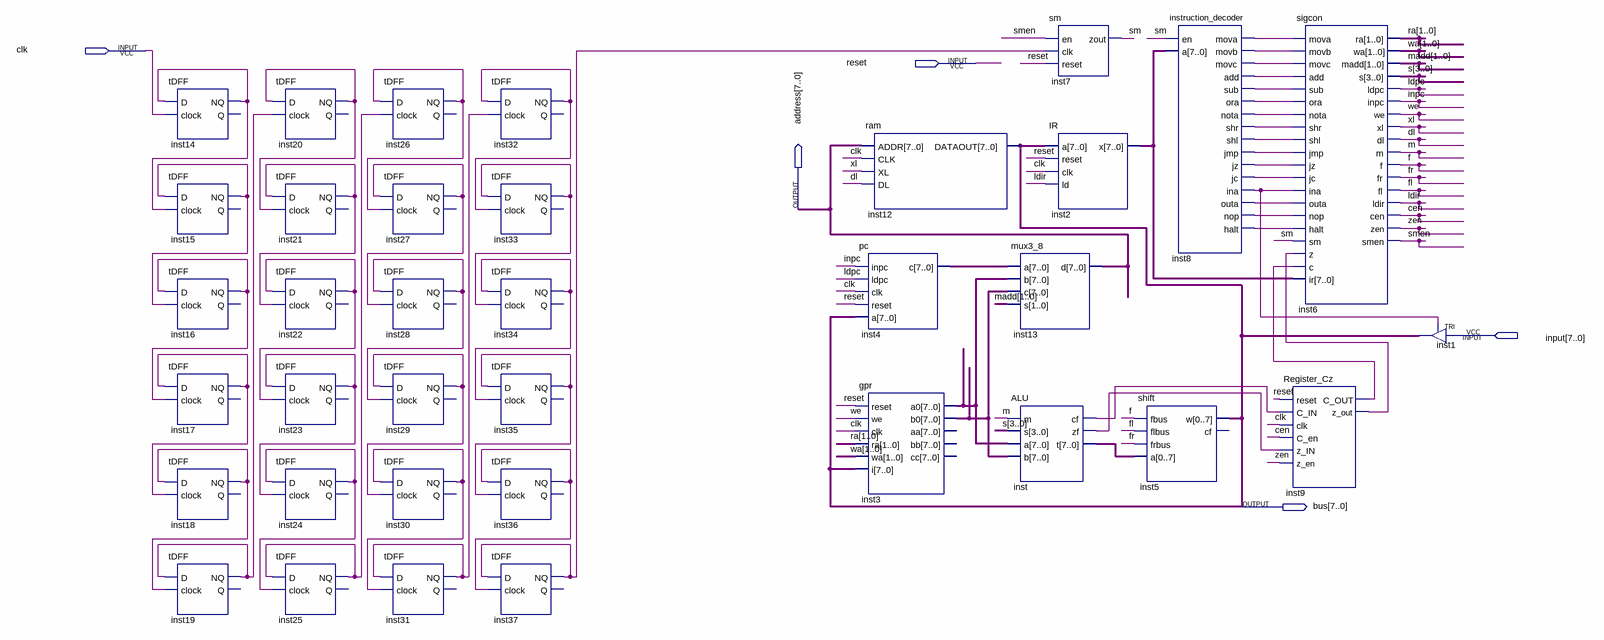
[diagram p0: schematic sheet]
// Quartus schematic cpu.bdf as structural Verilog: 36 symbols, 5 pins
module cpu (
  input  clk,
  input  reset,
  input  [7:0] \input ,
  output [7:0] address,
  output [7:0] bus
);

  wire cen, dl, f, fl, fr, inpc, inst8_add, inst8_halt, inst8_ina, inst8_jc, inst8_jmp, inst8_jz, inst8_mova,
       inst8_movb, inst8_movc, inst8_nop, inst8_nota, inst8_ora, inst8_outa, inst8_shl, inst8_shr, inst8_sub,
       inst9_c_out, inst9_z_out, inst14_nq, inst15_nq, inst16_nq, inst17_nq, inst18_nq, inst19_nq, inst20_nq,
       inst21_nq, inst22_nq, inst23_nq, inst24_nq, inst25_nq, inst26_nq, inst27_nq, inst28_nq, inst29_nq,
       inst30_nq, inst31_nq, inst32_nq, inst33_nq, inst34_nq, inst35_nq, inst36_nq, inst37_nq, inst_cf,
       inst_zf, ldir, ldpc, m, sm, smen, we, xl, zen;
  wire [1:0] madd, ra, wa;
  wire [3:0] s;
  wire [7:0] inst2_x, inst3_a0, inst3_b0, inst4_c, inst_t;

  tDFF inst14 (.D(inst14_nq), .clock(clk), .NQ(inst14_nq));  // open: Q
  tDFF inst15 (.D(inst15_nq), .clock(inst14_nq), .NQ(inst15_nq));  // open: Q
  tDFF inst16 (.D(inst16_nq), .clock(inst15_nq), .NQ(inst16_nq));  // open: Q
  tDFF inst17 (.D(inst17_nq), .clock(inst16_nq), .NQ(inst17_nq));  // open: Q
  tDFF inst18 (.D(inst18_nq), .clock(inst17_nq), .NQ(inst18_nq));  // open: Q
  tDFF inst19 (.D(inst19_nq), .clock(inst18_nq), .NQ(inst19_nq));  // open: Q
  tDFF inst20 (.D(inst20_nq), .clock(inst19_nq), .NQ(inst20_nq));  // open: Q
  tDFF inst21 (.D(inst21_nq), .clock(inst20_nq), .NQ(inst21_nq));  // open: Q
  tDFF inst22 (.D(inst22_nq), .clock(inst21_nq), .NQ(inst22_nq));  // open: Q
  tDFF inst23 (.D(inst23_nq), .clock(inst22_nq), .NQ(inst23_nq));  // open: Q
  tDFF inst24 (.D(inst24_nq), .clock(inst23_nq), .NQ(inst24_nq));  // open: Q
  tDFF inst25 (.D(inst25_nq), .clock(inst24_nq), .NQ(inst25_nq));  // open: Q
  tDFF inst26 (.D(inst26_nq), .clock(inst25_nq), .NQ(inst26_nq));  // open: Q
  tDFF inst27 (.D(inst27_nq), .clock(inst26_nq), .NQ(inst27_nq));  // open: Q
  tDFF inst28 (.D(inst28_nq), .clock(inst27_nq), .NQ(inst28_nq));  // open: Q
  tDFF inst29 (.D(inst29_nq), .clock(inst28_nq), .NQ(inst29_nq));  // open: Q
  tDFF inst30 (.D(inst30_nq), .clock(inst29_nq), .NQ(inst30_nq));  // open: Q
  tDFF inst31 (.D(inst31_nq), .clock(inst30_nq), .NQ(inst31_nq));  // open: Q
  tDFF inst32 (.D(inst32_nq), .clock(inst31_nq), .NQ(inst32_nq));  // open: Q
  tDFF inst33 (.D(inst33_nq), .clock(inst32_nq), .NQ(inst33_nq));  // open: Q
  tDFF inst34 (.D(inst34_nq), .clock(inst33_nq), .NQ(inst34_nq));  // open: Q
  tDFF inst35 (.D(inst35_nq), .clock(inst34_nq), .NQ(inst35_nq));  // open: Q
  tDFF inst36 (.D(inst36_nq), .clock(inst35_nq), .NQ(inst36_nq));  // open: Q
  tDFF inst37 (.D(inst37_nq), .clock(inst36_nq), .NQ(inst37_nq));  // open: Q
  ram inst12 (.ADDR(address), .CLK(clk), .XL(xl), .DL(dl), .DATAOUT(bus));
  pc inst4 (.inpc(inpc), .ldpc(ldpc), .clk(clk), .reset(reset), .a(bus), .c(inst4_c));
  gpr inst3 (
    .reset(reset), .we(we), .clk(clk), .ra(ra), .wa(wa), .i(bus), .a0(inst3_a0), .b0(inst3_b0));  // open: aa, bb, cc
  mux3_8 inst13 (.a(inst4_c), .b(inst3_a0), .c(inst3_b0), .s(madd), .d(address));
  ALU inst (.m(m), .s(s), .a(inst3_a0), .b(inst3_b0), .cf(inst_cf), .zf(inst_zf), .t(inst_t));
  sm inst7 (.en(smen), .clk(inst37_nq), .reset(reset), .zout(sm));
  IR inst2 (.a(bus), .reset(reset), .clk(clk), .ld(ldir), .x(inst2_x));
  instruction_decoder inst8 (
    .en(sm), .a(inst2_x), .mova(inst8_mova), .movb(inst8_movb), .movc(inst8_movc), .add(inst8_add),
    .sub(inst8_sub), .ora(inst8_ora), .nota(inst8_nota), .shr(inst8_shr), .shl(inst8_shl), .jmp(inst8_jmp),
    .jz(inst8_jz), .jc(inst8_jc), .ina(inst8_ina), .outa(inst8_outa), .nop(inst8_nop), .halt(inst8_halt));
  shift inst5 (.fbus(f), .flbus(fl), .frbus(fr), .a(inst_t), .w(bus));  // open: cf
  Register_Cz inst9 (
    .reset(reset), .C_IN(inst_cf), .clk(clk), .C_en(cen), .z_IN(inst_zf), .z_en(zen), .C_OUT(inst9_c_out),
    .z_out(inst9_z_out));
  sigcon inst6 (
    .mova(inst8_mova), .movb(inst8_movb), .movc(inst8_movc), .add(inst8_add), .sub(inst8_sub),
    .ora(inst8_ora), .nota(inst8_nota), .shr(inst8_shr), .shl(inst8_shl), .jmp(inst8_jmp), .jz(inst8_jz),
    .jc(inst8_jc), .ina(inst8_ina), .outa(inst8_outa), .nop(inst8_nop), .halt(inst8_halt), .sm(sm),
    .z(inst9_z_out), .c(inst9_c_out), .ir(inst2_x), .ra(ra), .wa(wa), .madd(madd), .s(s), .ldpc(ldpc),
    .inpc(inpc), .we(we), .xl(xl), .dl(dl), .m(m), .f(f), .fr(fr), .fl(fl), .ldir(ldir), .cen(cen),
    .zen(zen), .smen(smen));
  TRI inst1[7:0] (.IN(\input ), .OE(inst8_ina), .OUT(bus));
endmodule
